# Altium schematic sheet MCU_breakout.SchDoc
size A; SheetNumber: 2; SheetTotal: 7
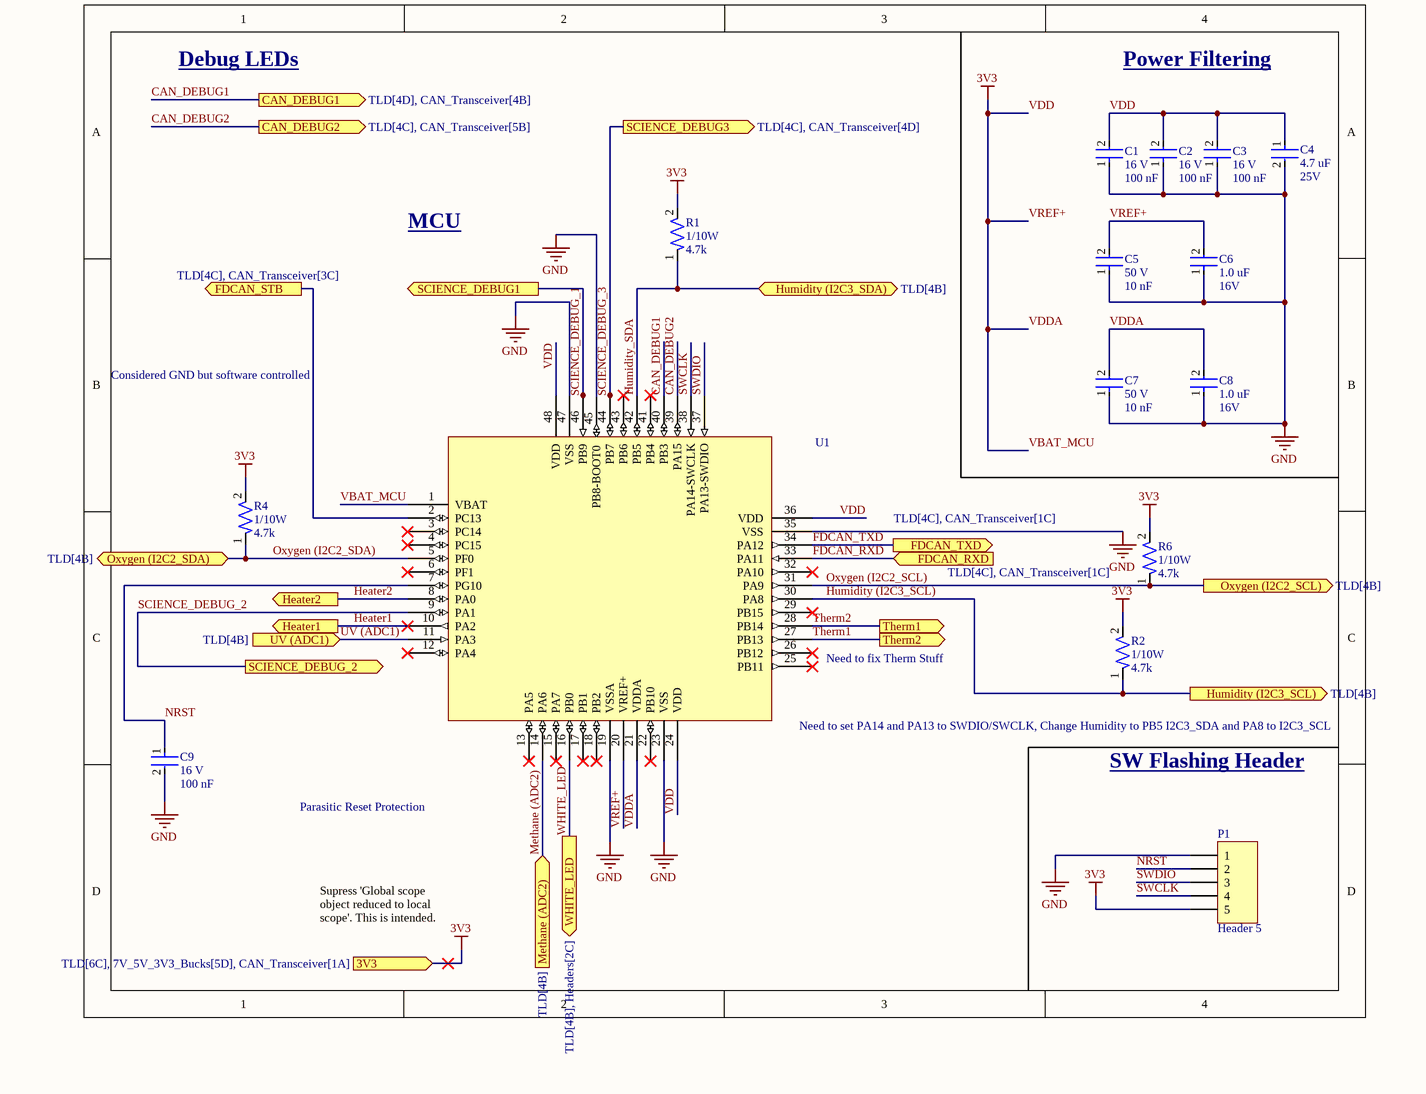
[diagram p0: MCU_breakout.SchDoc]

## Parts
C1  Voltage Rating: 16 V  Capacitance: 100 nF  [CAP-0402]  (hidden comment: CC0402KRX7R7BB104)
C2  Voltage Rating: 16 V  Capacitance: 100 nF  [CAP-0402]  (hidden comment: CC0402KRX7R7BB104)
C3  Voltage Rating: 16 V  Capacitance: 100 nF  [CAP-0402]  (hidden comment: CC0402KRX7R7BB104)
C4  Capacitance: 4.7 uF  Voltage: 25V  [CAP-0603]  (hidden comment: CC0603KRX5R8BB475)
C5  Voltage: 50 V  Capacitance: 10 nF  [CAP-0603]  (hidden comment: CC0603KPX7R9BB103)
C6  Capacitance: 1.0 uF  Voltage: 16V  [CAP-0603]  (hidden comment: CC0603KRX7R7BB105)
C7  Voltage: 50 V  Capacitance: 10 nF  [CAP-0603]  (hidden comment: CC0603KPX7R9BB103)
C8  Capacitance: 1.0 uF  Voltage: 16V  [CAP-0603]  (hidden comment: CC0603KRX7R7BB105)
C9  Voltage Rating: 16 V  Capacitance: 100 nF  [CAP-0402]  (hidden comment: CC0402KRX7R7BB104)
P1  Header 5  [HDR1X5]
R1  Power: 1/10W  Resistance: 4.7k  [RES-0603]  (hidden comment: RC0603FR-074K7L)
R2  Power: 1/10W  Resistance: 4.7k  [RES-0603]  (hidden comment: RC0603FR-074K7L)
R4  Power: 1/10W  Resistance: 4.7k  [RES-0603]  (hidden comment: RC0603FR-074K7L)
R6  Power: 1/10W  Resistance: 4.7k  [RES-0603]  (hidden comment: RC0603FR-074K7L)
U1  STM32G431CBT6  [IC-LQFP48]  (value not drawn)

## Ports
3V3 (in, see TLD[6C], 7V_5V_3V3_Bucks[5D], CAN_Transceiver[1A]), CAN_DEBUG1 (out, see TLD[4D], CAN_Transceiver[4B]), CAN_DEBUG2 (out, see TLD[4C], CAN_Transceiver[5B]), FDCAN_RXD (in, see TLD[4C], CAN_Transceiver[1C]), FDCAN_STB (out), FDCAN_TXD (out, see TLD[4C], CAN_Transceiver[1C]), Heater1 (out, see TLD[4D], Headers[1C]), Heater2 (out, see TLD[4D], Headers[1D]), Humidity (I2C3_SCL) (out, see TLD[4B]), Humidity (I2C3_SDA) (bidir, see TLD[4B]), Methane (ADC2) (in, see TLD[4B]), Oxygen (I2C2_SCL) (out, see TLD[4B]), Oxygen (I2C2_SDA) (bidir, see TLD[4B]), SCIENCE_DEBUG1 (out, see TLD[4C], CAN_Transceiver[3C]), SCIENCE_DEBUG3 (out, see TLD[4C], CAN_Transceiver[4D]), SCIENCE_DEBUG_2 (out), Therm1 (out, see TLD[4B], Headers[3B]), Therm2 (out, see TLD[4B], Headers[3B]), UV (ADC1) (in, see TLD[4B]), WHITE_LED (out, see TLD[4B], Headers[2C])

## Nets
GND: C1.1 C2.1 C3.1 C4.2 C5.1 C6.1 C7.1 C8.1 C9.2 P1.1 U1.19(VSSA) U1.23(VSS) U1.35(VSS) U1.45(PB8-BOOT0) U1.47(VSS)
VBAT_MCU: C1.2 C2.2 C3.2 C4.1 C5.2 C6.2 C7.2 C8.2 P1.5 R1.2 R2.2 R4.2 R6.2 U1.1(VBAT) U1.20(VREF+) U1.21(VDDA) U1.24(VDD) U1.36(VDD) U1.48(VDD) ; port 3V3  [also labelled 3V3, VDD, VDDA, VREF+]
CAN_DEBUG1: U1.40(PB3) ; port CAN_DEBUG1
CAN_DEBUG2: U1.39(PA15) ; port CAN_DEBUG2
FDCAN_RXD: U1.33(PA11) ; port FDCAN_RXD
FDCAN_STB: U1.2(PC13) ; port FDCAN_STB
FDCAN_TXD: U1.34(PA12) ; port FDCAN_TXD
Heater1: U1.10(PA2) ; port Heater1
Heater2: U1.8(PA0) ; port Heater2
Humidity (I2C3_SCL): R2.1 U1.30(PA8) ; port Humidity (I2C3_SCL)
Humidity_SDA: R1.1 U1.42(PB5) ; port Humidity (I2C3_SDA)
Methane (ADC2): U1.14(PA6) ; port Methane (ADC2)
NRST: C9.1 P1.2 U1.7(PG10)
Oxygen (I2C2_SCL): R6.1 U1.31(PA9) ; port Oxygen (I2C2_SCL)
Oxygen (I2C2_SDA): R4.1 U1.5(PF0) ; port Oxygen (I2C2_SDA)
SCIENCE_DEBUG_1: U1.46(PB9) ; port SCIENCE_DEBUG1
SCIENCE_DEBUG_2: U1.9(PA1) ; port SCIENCE_DEBUG_2
SCIENCE_DEBUG_3: U1.44(PB7) ; port SCIENCE_DEBUG3
SWCLK: P1.4 U1.38(PA14-SWCLK)
SWDIO: P1.3 U1.37(PA13-SWDIO)
Therm1: U1.27(PB13) ; port Therm2
Therm2: U1.28(PB14) ; port Therm1
UV (ADC1): U1.11(PA3) ; port UV (ADC1)
WHITE_LED: U1.16(PB0) ; port WHITE_LED

Not connected (* = marked no-connect by the designer): U1 3(PC14)* 4(PC15)* 6(PF1)* 12(PA4)* 13(PA5)* 15(PA7)* 17(PB1)* 18(PB2)* 22(PB10)* 25(PB11)* 26(PB12)* 29(PB15)* 32(PA10)* 41(PB4)* 43(PB6)*

## Notes on the sheet
- Debug LEDs
- Power Filtering
- MCU
- Considered GND but software controlled
- Need to fix Therm Stuff
- (near U1) Need to set PA14 and PA13 to SWDIO/SWCLK, Change Humidity to PB5 I2C3_SDA and PA8 to I2C3_SCL
- SW Flashing Header
- Parasitic Reset Protection
- Supress 'Global scope object reduced to local scope'. This is intended.

## Library data of the parts
C1-C3 C9 = CAP-0.1U-0001: CAP CER 0.1UF 16V X7R 0402; ComponentLink2Description: Datasheet; ComponentLink2URL: https://www.yageo.com/upload/media/product/productsearch/datasheet/mlcc/UPY-GPHC_X7R_6.3V-to-250V_24.pdf; Device Class: Ceramic; Size: 0402
C4 = CAP-4.7U-0001: CAP CER 4.7UF 25V X5R 0603; Device Class: Ceramic; Size: 0603
C5 C7 = CAP-10N-0002: CAP CER 10000PF 50V X7R 0603; ComponentLink2Description: Datasheet; ComponentLink2URL: http://www.yageo.com/documents/recent/UPY-GPHC_X7R_6.3V-to-50V_18.pdf; Device Class: Ceramic; Size: 0603
C6 C8 = CAP-1U-0002: CAP CER 1UF 16V X7R 0603; Device Class: Ceramic; Size: 0603
P1 = Header 5: Header, 5-Pin; LatestRevisionDate: 17-Jul-2002; LatestRevisionNote: Re-released for DXP Platform.; Publisher: Altium Limited
R1 R2 R4 R6 = RES-4.7k-0001: RES 4.7K OHM 1% 1/10W 0603; Tolerance: 1%; Size: 0603; ComponentLink1Description: Datasheet; ComponentLink1URL: https://www.yageo.com/upload/media/product/products/datasheet/rchip/PYu-RC_Group_51_RoHS_L_12.pdf
U1 = IC-STM32G431CBT6: IC MCU 32BIT 128KB FLASH 48LQFP; Package: 48LQFP; ComponentLink1Description: Datasheet; ComponentLink1URL: https://www.st.com/resource/en/datasheet/stm32g431cb.pdf